# Altium project tanker.PrjPcb
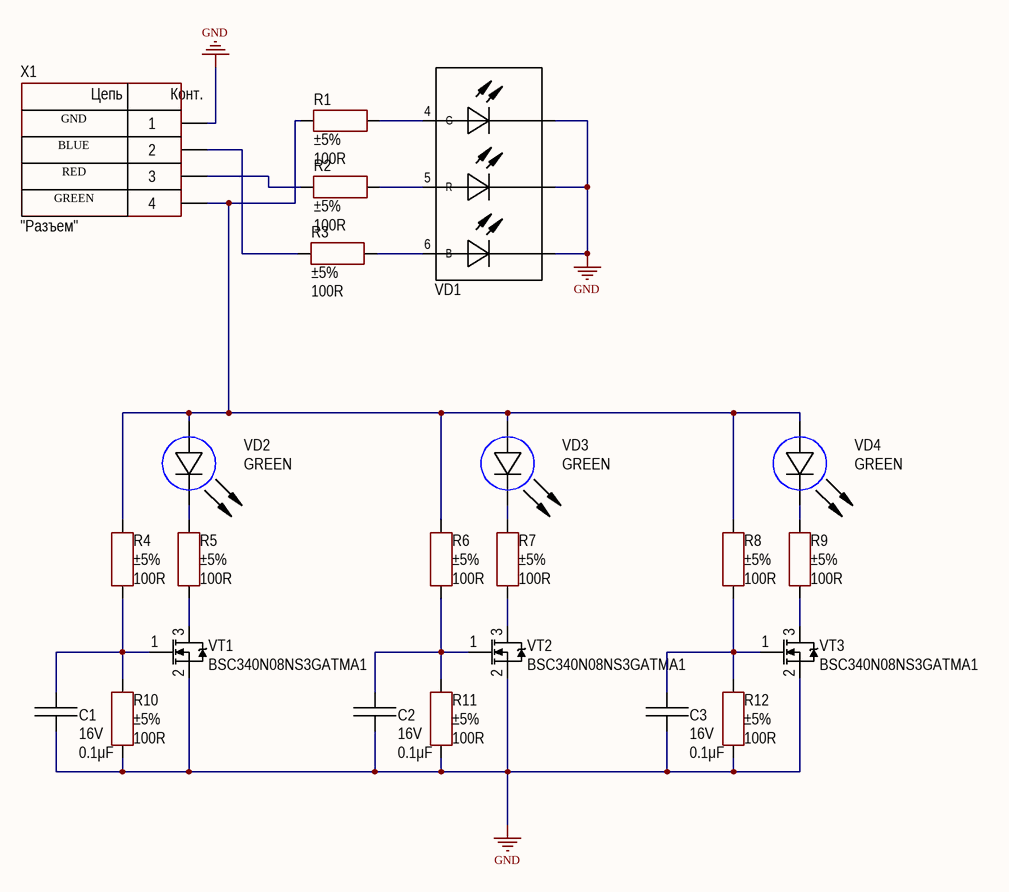
[diagram p0: tanker.SchDoc]
1 sheet, 23 parts. Net scope: global (net labels, ports and power ports of the same name join across sheets).
Board file: tanker.PcbDoc

## Sheet tanker.SchDoc
size 420 x 297 mm; Address1: Address1; Address2: Address2; Address3: Address3; Address4: Address4; DocumentNumber: АБВГ.123456.001 Э3; SheetNumber: 1; Scale: 1:1; DocumentType: Схема электрическая принципиальная; FirstReferrence: АБВГ.123456.001

### Parts
C1  value 0.1μF  Voltage: 16V  [CAP: 0805]
C2  value 0.1μF  Voltage: 16V  [CAP: 0805]
C3  value 0.1μF  Voltage: 16V  [CAP: 0805]
R1  value 100R  Tolerance: ±5%  [RES: 0603]
R2  value 100R  Tolerance: ±5%  [RES: 0603]
R3  value 100R  Tolerance: ±5%  [RES: 0603]
R4  value 100R  Tolerance: ±5%  [RES: 0603]
R5  value 100R  Tolerance: ±5%  [RES: 0603]
R6  value 100R  Tolerance: ±5%  [RES: 0603]
R7  value 100R  Tolerance: ±5%  [RES: 0603]
R8  value 100R  Tolerance: ±5%  [RES: 0603]
R9  value 100R  Tolerance: ±5%  [RES: 0603]
R10  value 100R  Tolerance: ±5%  [RES: 0603]
R11  value 100R  Tolerance: ±5%  [RES: 0603]
R12  value 100R  Tolerance: ±5%  [RES: 0603]
VD1  VD?  [RGB]  (value not drawn)
VD2  Color: GREEN  [LED: 0805G]
VD3  Color: GREEN  [LED: 0805G]
VD4  Color: GREEN  [LED: 0805G]
VT1  PartNumber: BSC340N08NS3GATMA1  [SOT23]
VT2  PartNumber: BSC340N08NS3GATMA1  [SOT23]
VT3  PartNumber: BSC340N08NS3GATMA1  [SOT23]
X1  CommentText: "Разъем"  [CON: PBS-4 R]

### Nets
GND: C1.1 C2.1 C3.1 R10.1 R11.1 R12.1 VD1.1(G) VD1.2(G) VD1.3(G) VT1.2(S) VT2.2(S) VT3.2(S) X1.1
NetC1_2: C1.2 R4.1 R10.2 VT1.1(G)
NetC2_2: C2.2 R6.1 R11.2 VT2.1(G)
NetC3_2: C3.2 R8.1 R12.2 VT3.1(G)
NetR1_1: R1.1 R4.2 R6.2 R8.2 VD2.1(A) VD3.1(A) VD4.1(A) X1.4
NetR1_2: R1.2 VD1.4(G)
NetR2_1: R2.1 X1.3
NetR2_2: R2.2 VD1.5(R)
NetR3_1: R3.1 X1.2
NetR3_2: R3.2 VD1.6(B)
NetR5_1: R5.1 VT1.3(D)
NetR5_2: R5.2 VD2.2(C)
NetR7_1: R7.1 VT2.3(D)
NetR7_2: R7.2 VD3.2(C)
NetR9_1: R9.1 VT3.3(D)
NetR9_2: R9.2 VD4.2(C)

### Notes on the sheet
- (near X1) GND
- (near X1) BLUE
- (near X1) RED
- (near X1) GREEN
- Перв. примен.
- Справ. №
- Подп. и дата
- Инв. № дубл.
- Взам. инв. №
- Разраб.
- Изм.
- Лист
- № докум.
- Подп.
- Дата
- Лит.
- Масса
- Масштаб
- Пров.
- Т.контр.
- Листов
- Инв. № подл.
- Утв.
- Н.контр.
- 2.106-A3
- Копировал
- Формат А3
- (in symbol PBS-4) Цепь; Конт.

### Library data of the parts
C1-C3 = Ceramic_0805: Manufacturer: Yageo; PartNumber: CC0805KRX7R7BB104; ValueManufacturerPartNumber: Ceramic capacitor, 0.1μF, X7R, ±10%, 16V, 0805, -55...+125°C; TypeCapacitor: Ceramic capacitor; Tolerance: ±10%; TypeDielectric: X7R; Package: 0805; HelpURL: https://www.digikey.com/product-detail/en/yageo/CC0805KRX7R7BB104/311-1142-1-ND/303052; Temperature: -55...+125°C
R1-R12 = Resistor_0603: Manufacturer: Yageo; PartNumber: RC0603JR-07100RL; ValueManufacturerPartNumber: Resistor film, 100R, ±5%, 0603, 0.1W, -55...+125°C; TypeResistor: Resistor film; Power: 0.1W; Package: 0603; HelpURL: https://www.digikey.com/product-detail/en/yageo/RC0603JR-07100RL/311-100GRCT-ND/729644; Temperature: -55...+125°C
VD1 = RGB
VD2-VD4 = LED_single: ValueManufacturerPartNumber: LED, *, *, *, -55...+150°C; TypeDiode: LED; Manufacturer: *; Package: *; HelpURL: *; Temperature: -55...+150°C; Current: *; VoltageDrop: *; PartNumber: *
VT1-VT3 = MOSFET_N_132: Manufacturer: Infineon Technologies; ValueManufacturerPartNumber: MOSFET N-channel transistor, 80V, 7A, 9.1nC, 2.5W, 34mOhm, 756pF, 8-TDSON, -55...+150°C; TypeTransistor: MOSFET N-channel transistor; VoltageDS: 80V; CurrentDS: 7A; RDS: 34mOhm; GateCharge: 9.1nC; InputCapacitor: 756pF; MaxPower: 2.5W; Package: 8-TDSON; HelpURL: https://www.digikey.com/product-detail/en/infineon-technologies/BSC340N08NS3GATMA1/BSC340N08NS3GATMA1TR-ND/2080655; Temperature: -55...+150°C
X1 = PBS-4: Manufacturer: Connfly; ValueManufacturerPartNumber: Connector, 4pin, 2.54mm, 500VAC, 3A; TypeConnector: Connector; VoltageMax: 500VAC; Pitch: 2.54mm; CurrentMax: 3A; Multichannel: 4pin; HelpURL: https://www.chipdip.ru/product/pbs-4; PartNumber: PBS-4